# EAGLE design untitled (EAGLE 9.6.2)
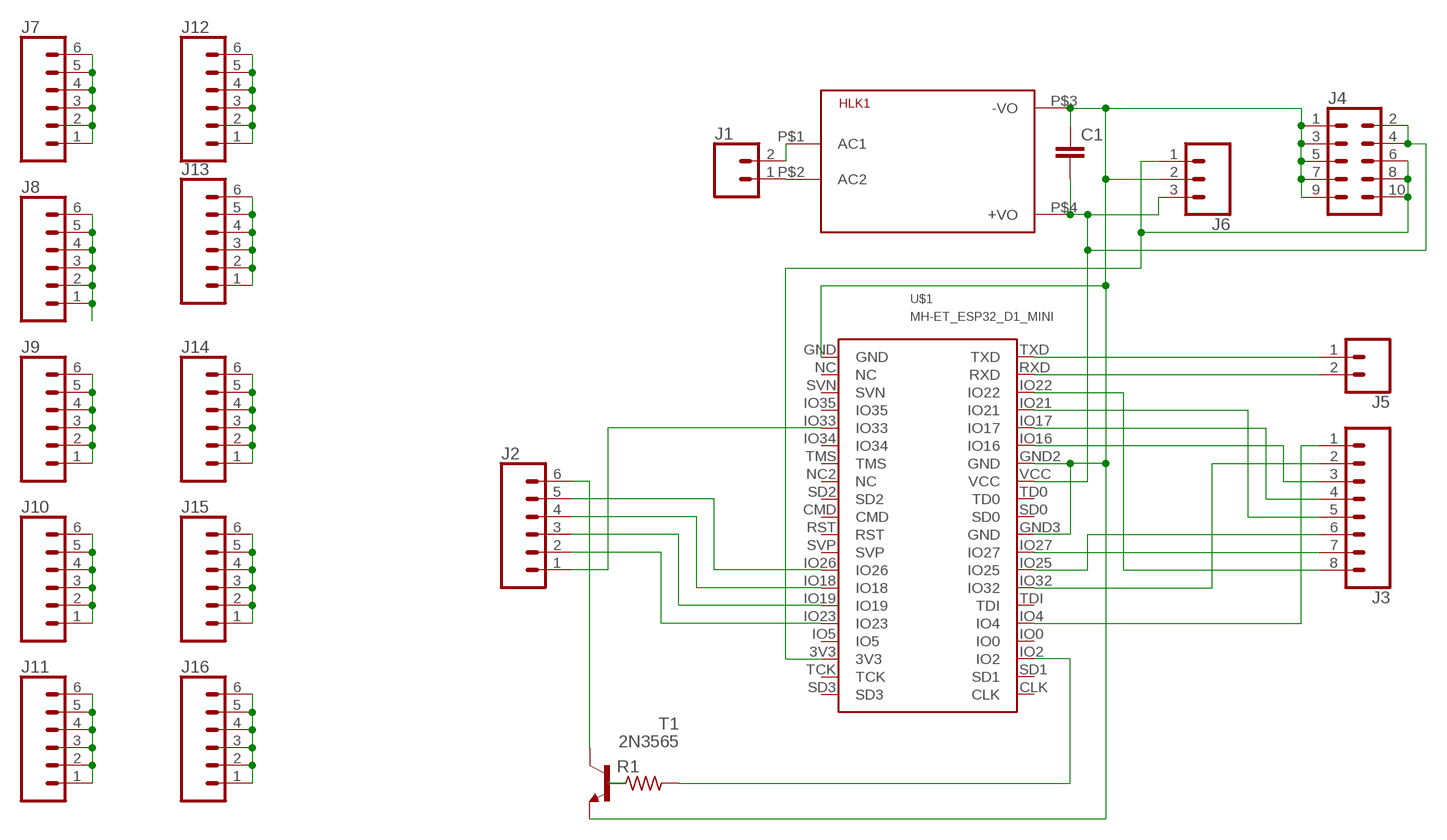
[diagram p0: schematic, sheet 1]

## Parts
C1  C2.5/2  [C2.5-2]
HLK1  HLK-PM013W  [HLK-PM01]
J1  CONN_023.5MM  [SCREWTERMINAL-3.5MM-2]
J2  CONN_063.5MM-6  [SCREWTERMINAL-3.5MM-6]
J3  CONN_083.5MM-8  [SCREWTERMINAL-3.5MM-8]
J4  CONN_05X2NO_SILK  [2X5_NOSILK]
J5  CONN_02  [1X02]
J6  CONN_03SCREW  [SCREWTERMINAL-3.5MM-3]
J7  CONN_06SILK_FEMALE_PTH  [1X06]
J8  CONN_06SILK_FEMALE_PTH  [1X06]
J9  CONN_06SILK_FEMALE_PTH  [1X06]
J10  CONN_06SILK_FEMALE_PTH  [1X06]
J11  CONN_06SILK_FEMALE_PTH  [1X06]
J12  CONN_06SILK_FEMALE_PTH  [1X06]
J13  CONN_06SILK_FEMALE_PTH  [1X06]
J14  CONN_06SILK_FEMALE_PTH  [1X06]
J15  CONN_06SILK_FEMALE_PTH  [1X06]
J16  CONN_06SILK_FEMALE_PTH  [1X06]
R1  R-US_0204/5  [0204/5]
T1  2N3565  [TO92]
U$1  MH-ET_ESP32_D1_MINI  [MH-ET_ESP32_D1_MINI]

## Nets
GND: C1.1 HLK1.P$3(-VO) J4.1 J4.3 J4.5 J4.7 J4.9 J6.2 T1.3(E) U$1.GND U$1.GND2(GND) U$1.GND3(GND)
N$1: HLK1.P$2(AC2) J1.1
N$2: R1.1 T1.2(B)
N$3: J2.6 T1.1(C)
N$4: J2.5 U$1.IO26
N$5: J2.4 U$1.IO18
N$6: J2.3 U$1.IO19
N$7: J2.2 U$1.IO23
N$8: J2.1 U$1.IO33
N$9: HLK1.P$1(AC1) J1.2
N$11: C1.2 HLK1.P$4(+VO) J4.2 J4.4 J6.3 U$1.VCC
N$12: J5.1 U$1.TXD
N$13: J5.2 U$1.RXD
N$14: J4.6 J4.8 J4.10 J6.1 U$1.3V3
N$15: R1.2 U$1.IO2
N$16: J3.8 U$1.IO22
N$17: J3.6 U$1.IO25
N$18: J3.3 U$1.IO16
N$19: J3.4 U$1.IO17
N$20: J3.7 U$1.IO27
N$21: J3.5 U$1.IO21
N$22: J3.1 U$1.IO4
N$23: J3.2 U$1.IO32
N$24: J7.1 J7.2 J7.3 J7.4 J7.5 J7.6
N$25: J8.1 J8.2 J8.3 J8.4 J8.5 J8.6
N$26: J9.1 J9.2 J9.3 J9.4 J9.5 J9.6
N$27: J10.1 J10.2 J10.3 J10.4 J10.5 J10.6
N$28: J11.1 J11.2 J11.3 J11.4 J11.5 J11.6
N$29: J12.1 J12.2 J12.3 J12.4 J12.5 J12.6
N$30: J13.1 J13.2 J13.3 J13.4 J13.5 J13.6
N$31: J14.1 J14.2 J14.3 J14.4 J14.5 J14.6
N$32: J15.1 J15.2 J15.3 J15.4 J15.5 J15.6
N$33: J16.1 J16.2 J16.3 J16.4 J16.5 J16.6
Unconnected: U$1.CLK U$1.CMD U$1.IO0 U$1.IO5 U$1.IO34 U$1.IO35 U$1.NC U$1.NC2(NC) U$1.RST U$1.SD0 U$1.SD1 U$1.SD2 U$1.SD3 U$1.SVN U$1.SVP U$1.TCK U$1.TD0 U$1.TDI U$1.TMS

## Library data of the parts
C1 = capacitor-wima:C: CAPACITOR naming: grid - package width
HLK1 = HLK-PM01:HLK-PM01: Hi-Link Power Supply HLK-PM01 3W Author: Ahmed Said <https://github.com/AhmedSaid/EAGLELibraries>
J1 = SparkFun-Connectors:CONN_02: Multi connection point. Often used as Generic Header-pin footprint for 0.1 inch spaced/style header connections On any of the 0.1 inch spaced packages, you can populate with these: Break Away Headers - Straight <https://www.sparkfun.com/products/116> (PRT-00116) Break Away Male Headers - Right Angle <https://www.sparkfun.com/products/553> (PRT-00553) Female Headers <https://www.sparkfun.com/products/115> (PRT-00115) Break Away Headers - Machine Pin <https://www.sparkfun.com/products/117> (PRT-00117) Break Away Female Headers - Swiss Machine Pin <https://www.sparkfun.com/products/743> (PRT-00743) For SCREWTERMINALS and SPRING TERMINALS visit here: Screw Terimnals on SparkFun.com <https://www.sparkfun.com/search/results?term=Screw+Terminals> (5mm/3.5mm/2.54mm spacing) This device is also useful as a general connection point to wire up your design to another part of your project. Our various solder wires solder well into these plated through hole pads. Hook-Up Wire - Assortment (Stranded, 22 AWG) <https://www.sparkfun.com/products/11375> (PRT-11375) Hook-Up Wire - Assortment (Solid Core, 22 AWG) <https://www.sparkfun.com/products/11367> (PRT-11367) View the entire wire category on our website here <https://www.sparkfun.com/categories/141> Special notes: Molex polarized connector foot print use with: PRT-08233 with associated crimp pins and housings. 2.54_SCREWTERM for use with PRT-10571. 3.5mm Screw Terminal footprints for PRT-08084 5mm Screw Terminal footprints for use with PRT-08432; PROD_ID: CONN-08399
J2 = SparkFun-Connectors:CONN_06: Multi connection point. Often used as Generic Header-pin footprint for 0.1 inch spaced/style header connections On any of the 0.1 inch spaced packages, you can populate with these: Break Away Headers - Straight <https://www.sparkfun.com/products/116> (PRT-00116) Break Away Male Headers - Right Angle <https://www.sparkfun.com/products/553> (PRT-00553) Female Headers <https://www.sparkfun.com/products/115> (PRT-00115) Break Away Headers - Machine Pin <https://www.sparkfun.com/products/117> (PRT-00117) Break Away Female Headers - Swiss Machine Pin <https://www.sparkfun.com/products/743> (PRT-00743) Arduino Stackable Header - 6 Pin <https://www.sparkfun.com/products/9280> (PRT-09280) For SCREWTERMINALS and SPRING TERMINALS visit here: Screw Terimnals on SparkFun.com <https://www.sparkfun.com/search/results?term=Screw+Terminals> (5mm/3.5mm/2.54mm spacing) This device is also useful as a general connection point to wire up your design to another part of your project. Our various solder wires solder well into these plated through hole pads. Hook-Up Wire - Assortment (Stranded, 22 AWG) <https://www.sparkfun.com/products/11375> (PRT-11375) Hook-Up Wire - Assortment (Solid Core, 22 AWG) <https://www.sparkfun.com/products/11367> (PRT-11367) View the entire wire category on our website here <https://www.sparkfun.com/categories/141>
J3 = SparkFun-Connectors:CONN_08: Multi connection point. Often used as Generic Header-pin footprint for 0.1 inch spaced/style header connections On any of the 0.1 inch spaced packages, you can populate with these: Break Away Headers - Straight <https://www.sparkfun.com/products/116> (PRT-00116) Break Away Male Headers - Right Angle <https://www.sparkfun.com/products/553> (PRT-00553) Female Headers <https://www.sparkfun.com/products/115> (PRT-00115) Break Away Headers - Machine Pin <https://www.sparkfun.com/products/117> (PRT-00117) Break Away Female Headers - Swiss Machine Pin <https://www.sparkfun.com/products/743> (PRT-00743) Arduino Stackable Header - 8 Pin <https://www.sparkfun.com/products/9279> (PRT-09279) For SCREWTERMINALS and SPRING TERMINALS visit here: Screw Terimnals on SparkFun.com <https://www.sparkfun.com/search/results?term=Screw+Terminals> (5mm/3.5mm/2.54mm spacing) This device is also useful as a general connection point to wire up your design to another part of your project. Our various solder wires solder well into these plated through hole pads. Hook-Up Wire - Assortment (Stranded, 22 AWG) <https://www.sparkfun.com/products/11375> (PRT-11375) Hook-Up Wire - Assortment (Solid Core, 22 AWG) <https://www.sparkfun.com/products/11367> (PRT-11367) View the entire wire category on our website here <https://www.sparkfun.com/categories/141> Special notes: Molex polarized connector foot print use with SKU : PRT-08231 with associated crimp pins and housings. 1MM SMD Version SKU: PRT-10208 NOTES ON THE VARIANTS LOCK and LOCK_LONGPADS... This footprint was designed to help hold the alignment of a through-hole component (i.e. 6-pin header) while soldering it into place. You may notice that each hole has been shifted either up or down by 0.005 of an inch from it's more standard position (which is a perfectly straight line). This slight alteration caused the pins (the squares in the middle) to touch the edges of the holes. Because they are alternating, it causes a "brace" to hold the component in place. 0.005 has proven to be the perfect amount of "off-center" position when using our standard breakaway headers. Although looks a little odd when you look at the bare footprint, once you have a header in there, the alteration is very hard to notice. Also,if you push a header all the way into place, it is covered up entirely on the bottom side.
J4 = SparkFun-Connectors:CONN_05X2: Multi connection point. Often used as Generic Header-pin footprint for 0.1 inch spaced/style header connections For AVR SPI programming port, see special device with nice symbol: "AVR_SPI_PROG_5x2.dev" You can populate with any combo of single row headers, but if you'd like an exact match, check these: 2x5 AVR ICSP Male Header <https://www.sparkfun.com/products/778> (PRT-00778) 2x5 Pin Shrouded Header <https://www.sparkfun.com/products/8506> (PRT-08506) On any of the 0.1 inch spaced packages, you can populate with these: Break Away Headers - Straight <https://www.sparkfun.com/products/116> (PRT-00116) Break Away Male Headers - Right Angle <https://www.sparkfun.com/products/553> (PRT-00553) Female Headers <https://www.sparkfun.com/products/115> (PRT-00115) Break Away Headers - Machine Pin <https://www.sparkfun.com/products/117> (PRT-00117) Break Away Female Headers - Swiss Machine Pin <https://www.sparkfun.com/products/743> (PRT-00743) Special note: the shrouded connector mates well with our 5x2 ribbon cables: 2x5 Pin IDC Ribbon Cable <https://www.sparkfun.com/products/8535> (PRT-08535)
J5 = SparkFun-Connectors:CONN_02: Multi connection point. Often used as Generic Header-pin footprint for 0.1 inch spaced/style header connections On any of the 0.1 inch spaced packages, you can populate with these: Break Away Headers - Straight <https://www.sparkfun.com/products/116> (PRT-00116) Break Away Male Headers - Right Angle <https://www.sparkfun.com/products/553> (PRT-00553) Female Headers <https://www.sparkfun.com/products/115> (PRT-00115) Break Away Headers - Machine Pin <https://www.sparkfun.com/products/117> (PRT-00117) Break Away Female Headers - Swiss Machine Pin <https://www.sparkfun.com/products/743> (PRT-00743) For SCREWTERMINALS and SPRING TERMINALS visit here: Screw Terimnals on SparkFun.com <https://www.sparkfun.com/search/results?term=Screw+Terminals> (5mm/3.5mm/2.54mm spacing) This device is also useful as a general connection point to wire up your design to another part of your project. Our various solder wires solder well into these plated through hole pads. Hook-Up Wire - Assortment (Stranded, 22 AWG) <https://www.sparkfun.com/products/11375> (PRT-11375) Hook-Up Wire - Assortment (Solid Core, 22 AWG) <https://www.sparkfun.com/products/11367> (PRT-11367) View the entire wire category on our website here <https://www.sparkfun.com/categories/141> Special notes: Molex polarized connector foot print use with: PRT-08233 with associated crimp pins and housings. 2.54_SCREWTERM for use with PRT-10571. 3.5mm Screw Terminal footprints for PRT-08084 5mm Screw Terminal footprints for use with PRT-08432
J6 = SparkFun-Connectors:CONN_03: Multi connection point. Often used as Generic Header-pin footprint for 0.1 inch spaced/style header connections On any of the 0.1 inch spaced packages, you can populate with these: Break Away Headers - Straight <https://www.sparkfun.com/products/116> (PRT-00116) Break Away Male Headers - Right Angle <https://www.sparkfun.com/products/553> (PRT-00553) Female Headers <https://www.sparkfun.com/products/115> (PRT-00115) Break Away Headers - Machine Pin <https://www.sparkfun.com/products/117> (PRT-00117) Break Away Female Headers - Swiss Machine Pin <https://www.sparkfun.com/products/743> (PRT-00743) Stackable Header - 3 Pin (Female, 0.1") <https://www.sparkfun.com/products/13875> (PRT-13875) For SCREWTERMINALS and SPRING TERMINALS visit here: Screw Terimnals on SparkFun.com <https://www.sparkfun.com/search/results?term=Screw+Terminals> (5mm/3.5mm/2.54mm spacing) This device is also useful as a general connection point to wire up your design to another part of your project. Our various solder wires solder well into these plated through hole pads. Hook-Up Wire - Assortment (Stranded, 22 AWG) <https://www.sparkfun.com/products/11375> (PRT-11375) Hook-Up Wire - Assortment (Solid Core, 22 AWG) <https://www.sparkfun.com/products/11367> (PRT-11367) View the entire wire category on our website here <https://www.sparkfun.com/categories/141> Special notes: Molex polarized connector foot print use with SKU : PRT-08232 with associated crimp pins and housings.; PROD_ID: CONN-08288; SF_ID: PRT-08235
J7-J16 = SparkFun-Connectors:CONN_06: Multi connection point. Often used as Generic Header-pin footprint for 0.1 inch spaced/style header connections On any of the 0.1 inch spaced packages, you can populate with these: Break Away Headers - Straight <https://www.sparkfun.com/products/116> (PRT-00116) Break Away Male Headers - Right Angle <https://www.sparkfun.com/products/553> (PRT-00553) Female Headers <https://www.sparkfun.com/products/115> (PRT-00115) Break Away Headers - Machine Pin <https://www.sparkfun.com/products/117> (PRT-00117) Break Away Female Headers - Swiss Machine Pin <https://www.sparkfun.com/products/743> (PRT-00743) Arduino Stackable Header - 6 Pin <https://www.sparkfun.com/products/9280> (PRT-09280) For SCREWTERMINALS and SPRING TERMINALS visit here: Screw Terimnals on SparkFun.com <https://www.sparkfun.com/search/results?term=Screw+Terminals> (5mm/3.5mm/2.54mm spacing) This device is also useful as a general connection point to wire up your design to another part of your project. Our various solder wires solder well into these plated through hole pads. Hook-Up Wire - Assortment (Stranded, 22 AWG) <https://www.sparkfun.com/products/11375> (PRT-11375) Hook-Up Wire - Assortment (Solid Core, 22 AWG) <https://www.sparkfun.com/products/11367> (PRT-11367) View the entire wire category on our website here <https://www.sparkfun.com/categories/141>; PROD_ID: CONN-08437
R1 = resistor:R-US_: RESISTOR, American symbol
T1 = transistor:2N3565: NPN TRANSISTOR
U$1 = MH-ET_ESP32_D1_MINI:MH-ET_ESP32_D1_MINI

## Board
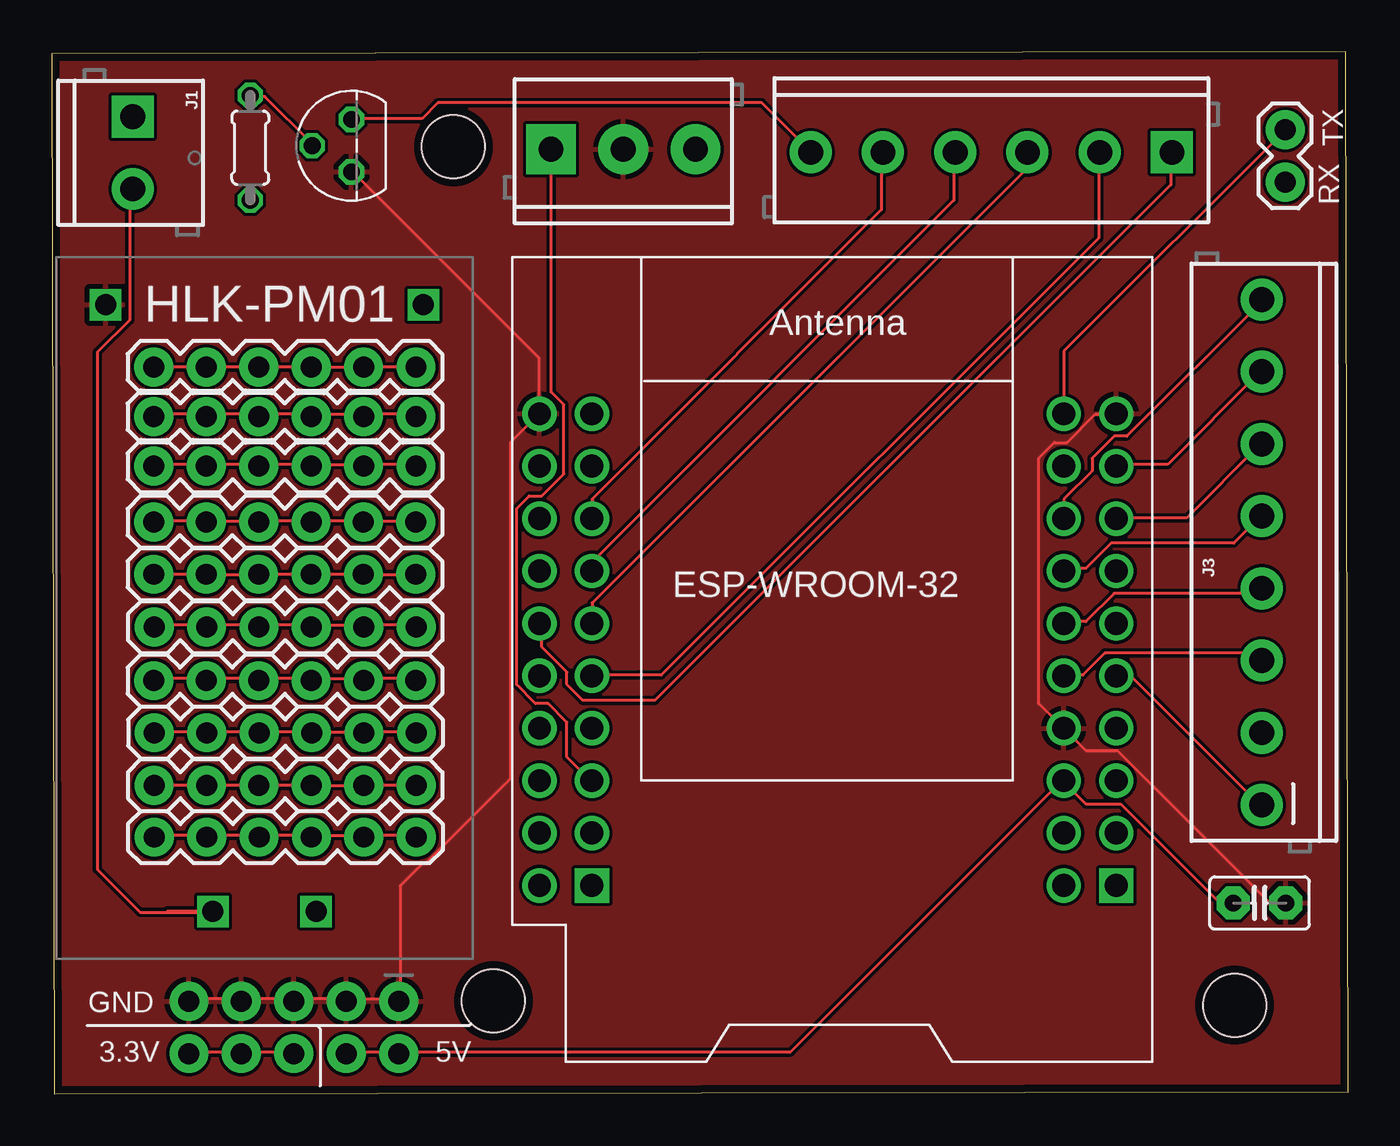
[diagram p1: board, top side]
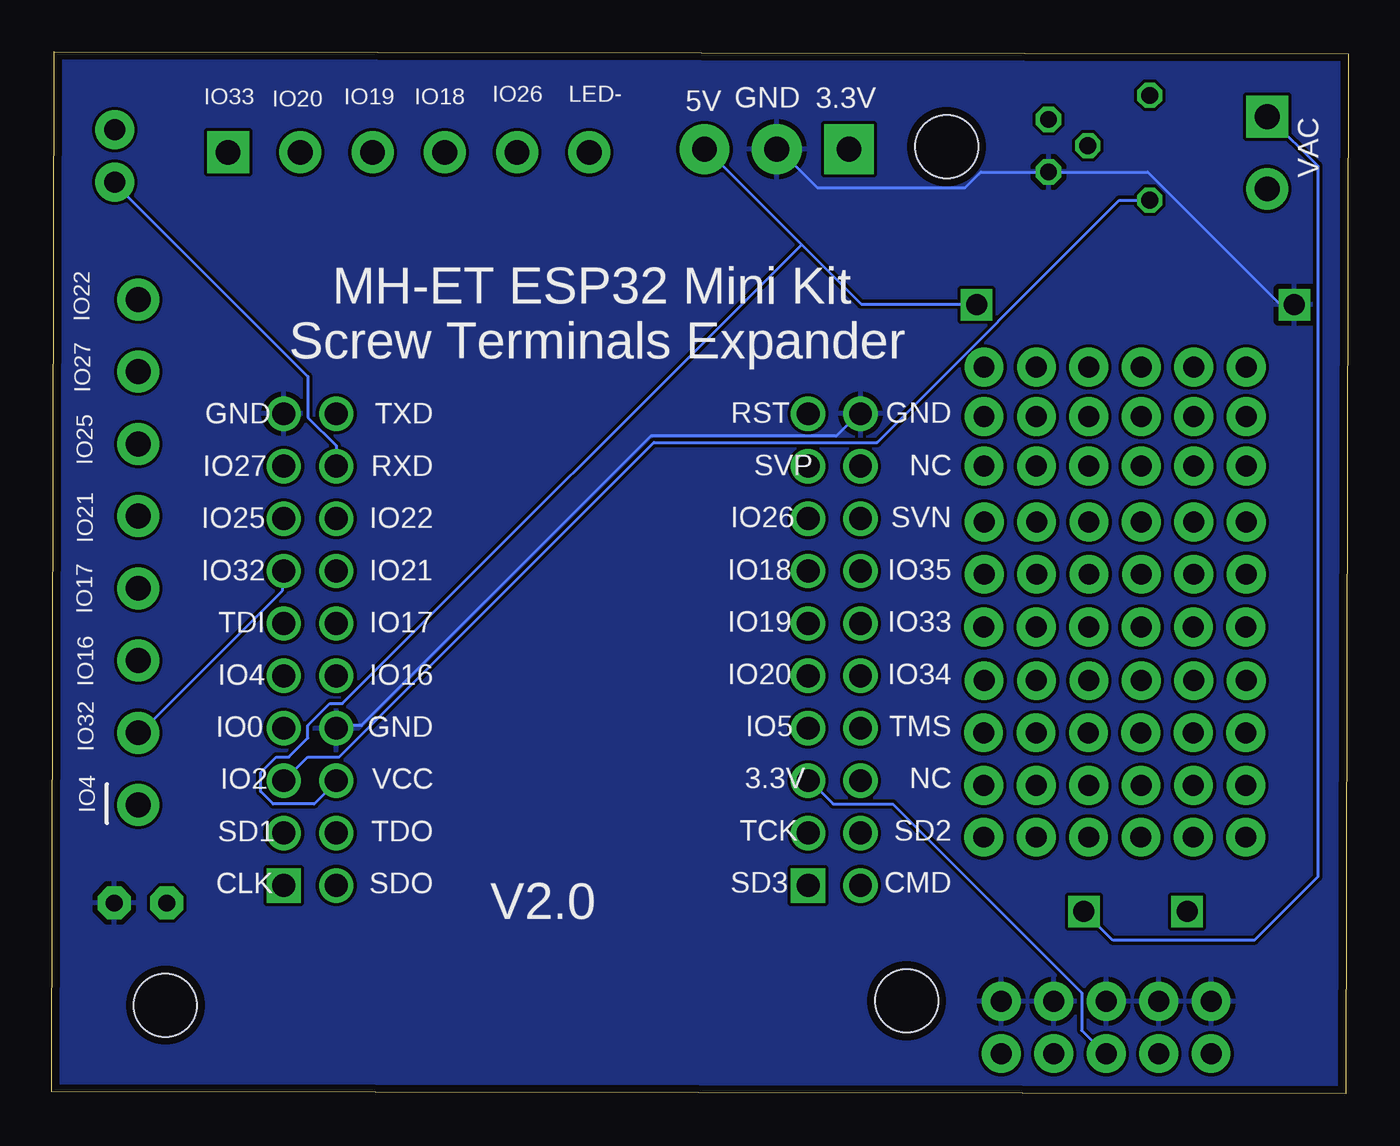
[diagram p2: board, bottom side, seen from below]

Size 62.83 x 50.53 mm. Coordinates in mm from the lower left corner, seen from the top.
Outline: 0.13,0 62.83,0.11 62.7,50.53 0,50.42 0.13,0
Copper layers (1*16): Top 0.035559375mm / dielectric 1.6mm / Bottom 0.035559375mm
Design rules "oshpark-2layer": minimum track width 6mil, minimum drill 10mil, track to track 6mil, track to pad 6mil, pad to pad 6mil, via to via 6mil, smd to smd 6mil, copper to edge 15mil, drill to drill 6mil, minimum pad ring 5mil, minimum via ring 5mil, stop-mask expansion 2.5mil, vias tented up to drill 0mil, thermal gap 10mil
Holes 3.05 mm at 57.31,4.31 21.4,4.52 19.47,45.91

### Footprints (pad centres in the part's own frame; a part is rotated, then mirrored left to right if it is on the bottom)
C2.5-2 = drill 0.813 pad 1.6 octagon: 1 -1.27,0; 2 1.27,0
HLK-PM01 = drill 1.016 square: P$1 -14.7,2.5; P$2 -14.7,-2.5; P$3 14.7,7.7; P$4 14.7,-7.7
SCREWTERMINAL-3.5MM-2 = drill 1.2 pad 2.032 square: 1 0,0 | drill 1.2 pad 2.032: 2 3.5,0
SCREWTERMINAL-3.5MM-6 = drill 1.2 pad 2.032 square: 1 0,0 | drill 1.2 pad 2.032: 2 3.5,0; 3 7,0; 4 10.5,0; 5 14,0; 6 17.5,0
SCREWTERMINAL-3.5MM-8 = drill 1.2 pad 2.032: 1 0,0; 2 3.5,0; 3 7,0; 4 10.5,0; 5 14,0; 6 17.5,0; 7 21,0; 8 24.5,0
2X5_NOSILK = drill 1.016 pad 1.88: 1 0,0; 2 0,2.54; 3 2.54,0; 4 2.54,2.54; 5 5.08,0; 6 5.08,2.54; 7 7.62,0; 8 7.62,2.54; 9 10.16,0; 10 10.16,2.54
1X02 = drill 1.016 pad 1.88: 1 0,0; 2 2.54,0
SCREWTERMINAL-3.5MM-3 = drill 1.2 pad 2.413 square: 1 0,0 | drill 1.2 pad 2.413: 2 3.5,0; 3 7,0
1X06 = drill 1.016 pad 1.88: 1 0,0; 2 2.54,0; 3 5.08,0; 4 7.62,0; 5 10.16,0; 6 12.7,0
0204/5 = drill 0.813 octagon: 1 -2.54,0; 2 2.54,0
TO92 = drill 0.813 octagon: 1 1.27,0; 2 0,1.905; 3 -1.27,0
MH-ET_ESP32_D1_MINI = drill 1.11 pad 1.665: 3V3 25.4,-5.08; CMD 27.94,0; GND 0,-22.86; GND2 2.54,-7.62; GND3 27.94,-22.86; IO0 0,-7.62; IO2 0,-5.08; IO4 0,-10.16; IO5 25.4,-7.62; IO16 2.54,-10.16; IO17 2.54,-12.7; IO18 25.4,-15.24; IO19 25.4,-12.7; IO21 2.54,-15.24; IO22 2.54,-17.78; IO23 25.4,-10.16; IO25 0,-17.78; IO26 25.4,-17.78; IO27 0,-20.32; IO32 0,-15.24; IO33 27.94,-12.7; IO34 27.94,-10.16; IO35 27.94,-15.24; NC 27.94,-20.32; NC2 27.94,-5.08; RST 25.4,-22.86; RXD 2.54,-20.32; SD0 2.54,0; SD1 0,-2.54; SD2 27.94,-2.54; SVN 27.94,-17.78; SVP 25.4,-20.32; TCK 25.4,-2.54; TD0 2.54,-2.54; TDI 0,-12.7; TMS 27.94,-7.62; TXD 2.54,-22.86; VCC 2.54,-5.08 | drill 1.11 pad 1.665 square: CLK 0,0; SD3 25.4,0

### Placement (x,y rotation side)
C1  58.52,9.25 180 top
HLK1  10.32,23.55 90 top
J1  3.93,47.37 270 top
J2  54.28,45.64 180 top
J3  58.63,14.01 90 top
J4  16.81,4.5 180 top
J5  59.77,46.74 270 top
J6  24.19,45.79 0 top
J7  4.95,35.24 0 top
J8  4.95,32.84 0 top
J9  4.95,30.43 0 top
J10  4.95,27.73 0 top
J11  4.95,25.19 0 top
J12  4.97,22.63 0 top
J13  4.95,20.04 0 top
J14  4.97,17.51 0 top
J15  4.97,14.96 0 top
J16  4.97,12.45 0 top
R1  9.63,45.86 270 top
T1  14.53,45.96 90 top
U$1  51.58,10.11 180 top

### Tracks (layer width: path | path; a pad name or v marks a point on that pad's centre or on a via)
GND
  Top 0.152: C1.1 59.71,9.33 58.95,9.33 51.64,16.64 50.11,16.64 49.04,17.71 U$1.GND2 48.89,17.86 47.83,18.93 47.83,30.82 48.59,31.58 49.2,31.58 50.57,32.95 51.48,32.95 U$1.GND | J4.9 6.68,4.6 9.12,4.6 J4.7 9.27,4.6 11.71,4.6 J4.5 11.86,4.6 14.15,4.6 J4.3 14.3,4.6 16.74,4.6 J4.1 16.89,4.6 16.89,10.09 17.96,11.16 18.11,11.16 22.22,15.27 22.22,31.58 23.59,32.95 U$1.GND3 23.59,33.1 23.59,35.69 14.6,44.68 T1.3
  Bottom 0.152: J6.2 27.56,45.75 25.73,43.92 18.56,43.92 17.8,44.68 14.6,44.68 T1.3 14.45,44.68 9.73,44.68 3.32,38.28 2.72,38.28 HLK1.P$3 | U$1.GND2 48.89,17.86 47.83,17.86 33.8,31.88 24.81,31.88 23.75,32.95 U$1.GND3
  pour Top: 0.14,50.58 62.73,50.58 62.83,50.68 62.83,0.16 0.14,0.16 0.03,0.05 0.03,50.68 0.14,50.79
  pour Bottom: 0.11,50.46 62.67,50.46 62.67,-0.01 0.02,-0.01
N$1
  Top 0.152: 12.77,8.87 HLK1.P$2 | 3.93,47.27 J1.1
  Bottom 0.152: 12.77,9.33 12.77,8.87 HLK1.P$2 11.42,7.45 4.56,7.45 1.5,10.51 1.5,44.99 3.78,47.27 J1.1
N$2
  Top 0.152: R1.1 9.73,48.34 10.34,48.34 12.62,46.06 T1.2
N$3
  Top 0.152: T1.1 14.6,47.27 17.96,47.27 18.72,48.04 34.41,48.04 36.7,45.75 J2.6
N$4
  Top 0.152: U$1.IO26 26.18,27.92 26.18,28.83 40.21,42.85 40.21,45.6 J2.5
N$5
  Top 0.152: U$1.IO18 26.18,25.48 26.18,25.79 43.71,43.31 43.71,45.6 J2.4
N$6
  Top 0.152: 26.03,22.89 U$1.IO19 26.18,22.89 26.18,23.8 47.22,44.84 47.22,45.6 J2.3 47.22,45.75
N$7
  Top 0.152: U$1.IO23 26.18,20.3 29.54,20.3 50.72,41.48 50.72,45.6 J2.2
N$8
  Top 0.152: U$1.IO33 23.75,22.74 23.75,21.67 24.97,20.45 24.97,19.84 25.73,19.08 29.23,19.08 54.23,44.07 54.23,45.6 J2.1
N$9
  Top 0.152: 3.93,43.77 J1.2 3.78,43.77 3.78,37.52 2.21,35.95 2.21,10.88 4.29,8.81 7.77,8.81 HLK1.P$1 7.74,8.87 5.61,8.87
N$11
  Top 0.152: J4.4 14.3,2.01 16.74,2.01 J4.2 16.89,2.01 35.79,2.01 48.89,15.12 U$1.VCC 49.04,15.12 50.11,14.05 51.79,14.05 56.51,9.33 57.12,9.33 C1.2
  Bottom 0.152: 26.49,41.18 31.06,45.75 J6.3 | 26.49,41.18 23.59,38.28 18.11,38.28 HLK1.P$4 | 26.49,41.18 48.74,18.93 49.35,18.93 50.42,17.86 50.42,17.25 51.33,16.34 51.94,16.34 52.7,15.58 52.7,14.66 52.09,14.05 50.11,14.05 49.04,15.12 U$1.VCC
N$12
  Top 0.152: U$1.TXD 49.04,33.1 49.04,36 59.71,46.66 J5.1
N$13
  Bottom 0.152: U$1.RXD 49.04,30.51 49.04,31.42 50.42,32.8 50.42,34.78 59.71,44.07 J5.2
N$14
  Top 0.152: J4.10 6.68,2.01 9.12,2.01 J4.8 9.27,2.01 11.71,2.01 J4.6 | J6.1 24.2,45.75 24.2,34.02 24.81,33.41 24.81,30.05 23.75,28.99 23.14,28.99 22.53,28.38 22.53,19.84 23.44,18.93 24.05,18.93 24.97,18.01 24.97,16.34 26.03,15.27 U$1.3V3
  Bottom 0.152: J4.6 11.86,2.01 12.93,3.08 12.93,4.91 22.07,14.05 24.97,14.05 26.03,15.12 U$1.3V3
N$15
  Bottom 0.152: R1.2 9.73,43.31 11.1,43.31 22.83,31.58 33.65,31.58 48.89,16.34 50.42,16.34 51.48,15.27 U$1.IO2
N$16
  Top 0.152: U$1.IO22 49.04,27.92 49.04,28.83 50.42,30.21 50.42,30.82 51.48,31.88 52.09,31.88 58.65,38.44 J3.8
N$17
  Top 0.152: U$1.IO25 51.64,27.92 54.99,27.92 58.49,31.42 J3.6
N$18
  Top 0.152: U$1.IO16 49.04,20.3 49.96,20.3 51.03,21.37 58.19,21.37 58.49,21.06 J3.3
N$19
  Top 0.152: U$1.IO17 49.04,22.89 50.11,22.89 51.48,24.26 58.34,24.26 58.49,24.41 J3.4
N$20
  Top 0.152: U$1.IO27 51.64,30.51 54.07,30.51 58.49,34.93 J3.7
N$21
  Top 0.152: U$1.IO21 49.04,25.48 50.11,25.48 51.33,26.7 57.27,26.7 58.49,27.92 J3.5
N$22
  Top 0.152: U$1.IO4 51.64,20.15 52.4,20.15 58.49,14.05 J3.1
N$23
  Bottom 0.152: U$1.IO32 51.64,25.33 51.64,24.41 58.49,17.56 J3.2
N$24
  Top 0.152: J7.6 15.21,35.23 J7.5 15.06,35.23 12.62,35.23 J7.4 12.47,35.23 10.18,35.23 J7.3 7.59,35.23 J7.2 7.44,35.23 5,35.23 J7.1
N$25
  Top 0.152: J8.6 17.65,32.95 15.21,32.95 J8.5 15.06,32.95 12.62,32.95 J8.4 12.47,32.95 10.18,32.95 J8.3 10.03,32.95 7.59,32.95 J8.2 7.44,32.95 5,32.95 J8.1
N$26
  Top 0.152: J9.6 17.65,30.51 15.21,30.51 J9.5 15.06,30.51 12.62,30.51 J9.4 12.47,30.51 10.18,30.51 J9.3 10.03,30.51 7.59,30.51 J9.2 7.44,30.51 5,30.51 J9.1
N$27
  Top 0.152: J10.1 5,27.77 7.44,27.77 J10.2 7.59,27.77 9.88,27.77 J10.3 10.03,27.77 12.47,27.77 J10.4 12.62,27.77 15.06,27.77 J10.5 15.21,27.77 17.5,27.77 J10.6
N$28
  Top 0.152: J11.1 5,25.18 7.44,25.18 J11.2 7.59,25.18 9.88,25.18 J11.3 10.03,25.18 12.47,25.18 J11.4 12.62,25.18 15.06,25.18 J11.5 15.21,25.18 17.5,25.18 J11.6
N$29
  Top 0.152: J12.6 17.65,22.74 15.21,22.74 J12.5 15.06,22.74 12.62,22.74 J12.4 12.47,22.74 10.18,22.74 J12.3 10.03,22.74 7.59,22.74 J12.2 7.44,22.74 5,22.74 J12.1
N$30
  Top 0.152: J13.6 17.65,20.15 15.21,20.15 J13.5 15.06,20.15 12.62,20.15 J13.4 12.47,20.15 10.18,20.15 J13.3 10.03,20.15 7.59,20.15 J13.2 7.44,20.15 5,20.15 J13.1
N$31
  Top 0.152: J14.6 17.65,17.56 15.21,17.56 J14.5 15.06,17.56 12.62,17.56 J14.4 12.47,17.56 10.18,17.56 J14.3 10.03,17.56 7.59,17.56 J14.2 7.44,17.56 5,17.56 J14.1
N$32
  Top 0.152: J15.6 17.65,14.97 15.21,14.97 J15.5 15.06,14.97 12.62,14.97 J15.4 12.47,14.97 10.18,14.97 J15.3 10.03,14.97 7.59,14.97 J15.2 7.44,14.97 5,14.97 J15.1
N$33
  Top 0.152: J16.6 17.65,12.53 15.21,12.53 J16.5 15.06,12.53 12.62,12.53 J16.4 12.47,12.53 10.18,12.53 J16.3 10.03,12.53 7.59,12.53 J16.2 7.44,12.53 5,12.53 J16.1

### Text on the board
tPlace: TX | RX | HLK-PM01 | GND | 3.3V | 5V
bPlace: IO18 | IO19 | IO20 | IO33 | VAC | 3.3V | GND | 5V | LED- | IO26 | IO22 | MH-ET ESP32 Mini Kit / Screw Terminals Expander | RST GND / SVP NC / IO26 SVN / IO18 IO35 / IO19 IO33 / IO20 IO34 / IO5 TMS / 3.3V NC / TCK SD2 / SD3 CMD | GND TXD / IO27 RXD / IO25 IO22 / IO32 IO21 / TDI IO17 / IO4 IO16 / IO0 GND / IO2 VCC / SD1 TDO / CLK SDO | IO27 | IO25 | IO21 | IO17 | IO16 | IO32 | IO4 | V2.0